# EAGLE design cosv-carrier-teensy40 (EAGLE 7.6.0)
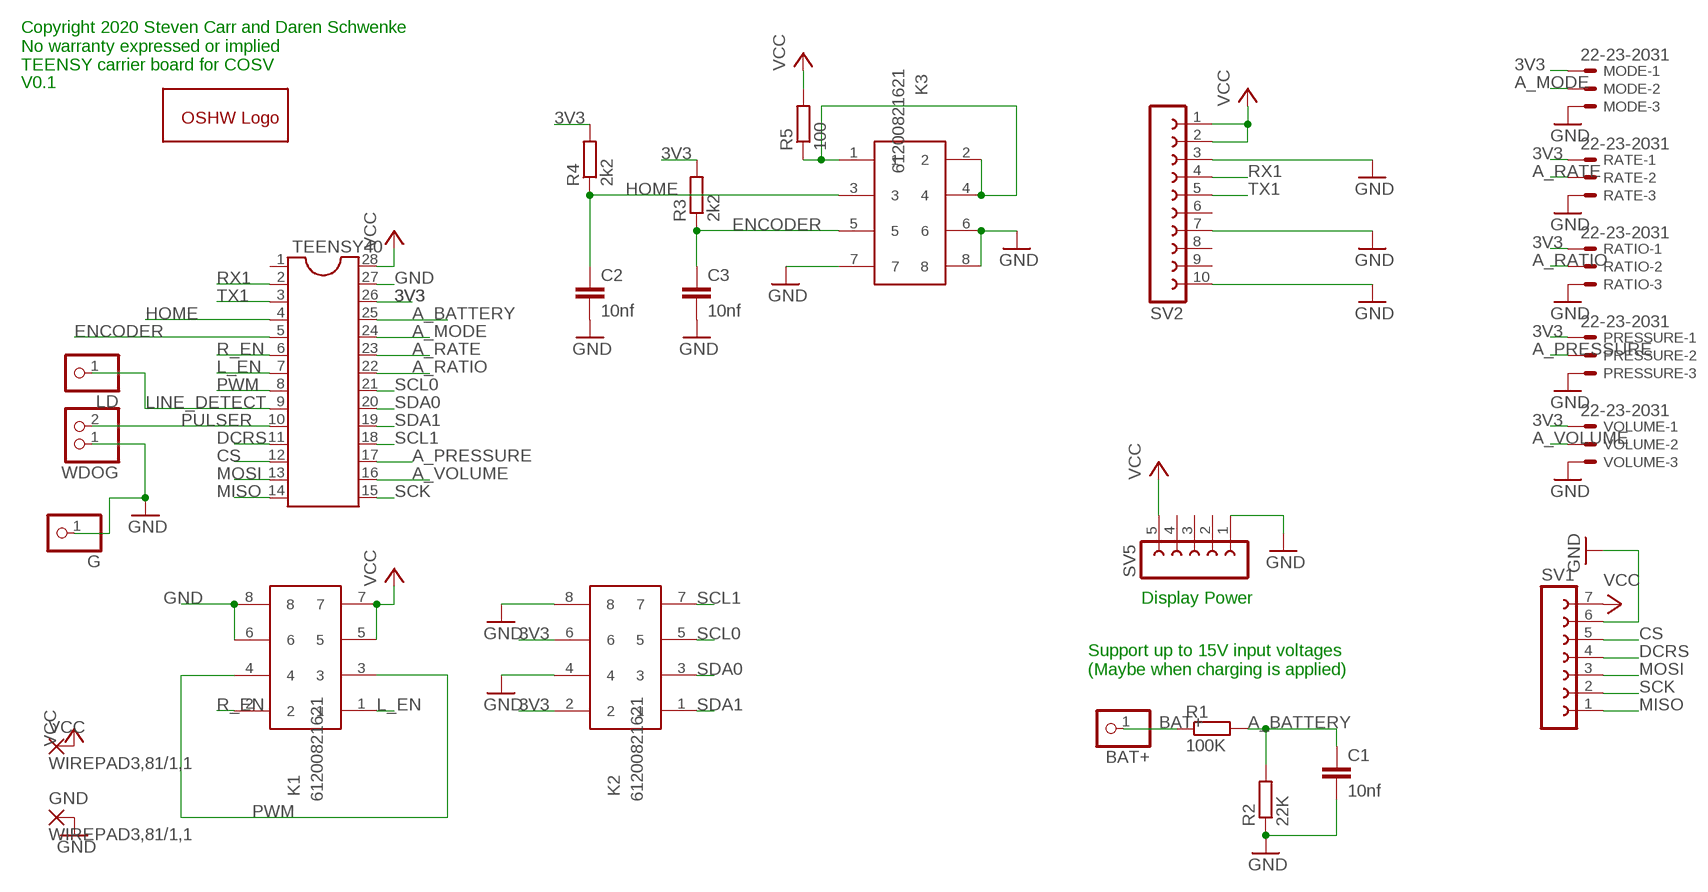
[diagram p0: schematic, sheet 1]

## Parts
BAT+  PINHD-1X01_2.54-S  [1X01-S]
C1  10nf  C-EUC1206  [C1206]
C2  10nf  C-EUC1206  [C1206]
C3  10nf  C-EUC1206  [C1206]
G  PINHD-1X01_2.54-S  [1X01-S]
GND  WIREPAD3,81/1,1  [3,81/1,1]
GOLD_ORB_SM1  OSHWLOGOLOGO8MM  [OSHW_8MM]
K1  61200821621  [61200821621]
K2  61200821621  [61200821621]
K3  61200821621  [61200821621]
LD  PINHD-1X01_2.54-S  [1X01-S]
MODE  22-23-2031  [22-23-2031]
PRESSURE  22-23-2031  [22-23-2031]
R1  100K  R-EU_R1206  [R1206]
R2  22K  R-EU_R1206  [R1206]
R3  2k2  R-EU_R1206  [R1206]
R4  2k2  R-EU_R1206  [R1206]
R5  100  R-EU_R1206  [R1206]
RATE  22-23-2031  [22-23-2031]
RATIO  22-23-2031  [22-23-2031]
SV1  FE07-1  [FE07]
SV2  FE10-1  [FE10]
SV5  FE05W  [FE05W]
TEENSY40  DIL28  [DIL28-6]
VCC  WIREPAD3,81/1,1  [3,81/1,1]
VOLUME  22-23-2031  [22-23-2031]
WDOG  PINHD-1X2  [1X02]

## Nets
3V3 [power]: K2.2 K2.6 MODE.1 PRESSURE.1 R3.2 R4.2 RATE.1 RATIO.1 TEENSY40.26 VOLUME.1
A_BATTERY: C1.1 R1.2 R2.2 TEENSY40.25
A_MODE: MODE.2 TEENSY40.24
A_PRESSURE: PRESSURE.2 TEENSY40.17
A_RATE: RATE.2 TEENSY40.23
A_RATIO: RATIO.2 TEENSY40.22
A_VOLUME: TEENSY40.16 VOLUME.2
BAT+: BAT+.1 R1.1
CS: SV1.5 TEENSY40.12
DCRS: SV1.4 TEENSY40.11
ENCODER: C3.1 K3.5 R3.1 TEENSY40.5
GND [ground]: C1.2 C2.2 C3.2 G.1 GND.1(P) K1.6 K1.8 K2.4 K2.8 K3.6 K3.7 K3.8 MODE.3 PRESSURE.3 R2.1 RATE.3 RATIO.3 SV1.6 SV2.3 SV2.7 SV2.10 SV5.1 TEENSY40.27 VOLUME.3 WDOG.1
HOME: C2.1 K3.3 R4.1 TEENSY40.4
L_EN: K1.1 TEENSY40.7
LINE_DETECT: LD.1 TEENSY40.9
MISO: SV1.1 TEENSY40.14
MOSI: SV1.3 TEENSY40.13
N$1: K3.1 K3.2 K3.4 R5.1
PULSER: TEENSY40.10 WDOG.2
PWM: K1.3 K1.4 TEENSY40.8
R_EN: K1.2 TEENSY40.6
RX1: SV2.4 TEENSY40.2
SCK: SV1.2 TEENSY40.15
SCL0: K2.5 TEENSY40.21
SCL1: K2.7 TEENSY40.18
SDA0: K2.3 TEENSY40.20
SDA1: K2.1 TEENSY40.19
TX1: SV2.5 TEENSY40.3
VCC [power]: K1.5 K1.7 R5.2 SV1.7 SV2.1 SV2.2 SV5.5 TEENSY40.28 VCC.1(P)
Unconnected: SV2.6 SV2.8 SV2.9 SV5.2 SV5.3 SV5.4 TEENSY40.1

## Notes on the sheet
- Copyright 2020 Steven Carr and Daren Schwenke
  No warranty expressed or implied
  TEENSY carrier board for COSV
- V0.1
- Display Power
- Support up to 15V input voltages
  (Maybe when charging is applied)

## Library data of the parts
BAT+ G LD = pinhead-2:PINHD-1X01: PIN HEADER
C1-C3 = rcl:C-EU: CAPACITOR, European symbol
GND VCC = wirepad:WIREPAD: Wire PAD connect wire on PCB
GOLD_ORB_SM1 = oshw:OSHWLOGO: The OSHW logo for PCB layout
K1-K3 = Wuerth_Elektronik_eiCan_05_Box_Header_IDC_Connectors_1_2:61200821621: WR-BHD 2.54mm Male Box Header, 8 Pins
MODE PRESSURE RATE RATIO VOLUME = con-molex:22-23-2031: .100" (2.54mm) Center Header - 3 Pin; MF: MOLEX; MPN: 22-23-2031; OC_FARNELL: 1462950; OC_NEWARK: 30C0862
R1-R5 = resistor:R-EU_: RESISTOR, European symbol
SV1 = con-lsta:FE07-1: FEMALE HEADER; OC_FARNELL: unknown; OC_NEWARK: unknown
SV2 = con-lsta:FE10-1: FEMALE HEADER; OC_FARNELL: unknown; OC_NEWARK: unknown
SV5 = con-lsta:FE05W: FEMALE HEADER; OC_FARNELL: unknown; OC_NEWARK: unknown
TEENSY40 = ic-package:DIL28: Dual In Line
WDOG = pinhead:PINHD-1X2: PIN HEADER

## Net classes
0 default: width 0.254 mm
1 ground: width 0.508 mm
2 power: width 0.508 mm

## Board
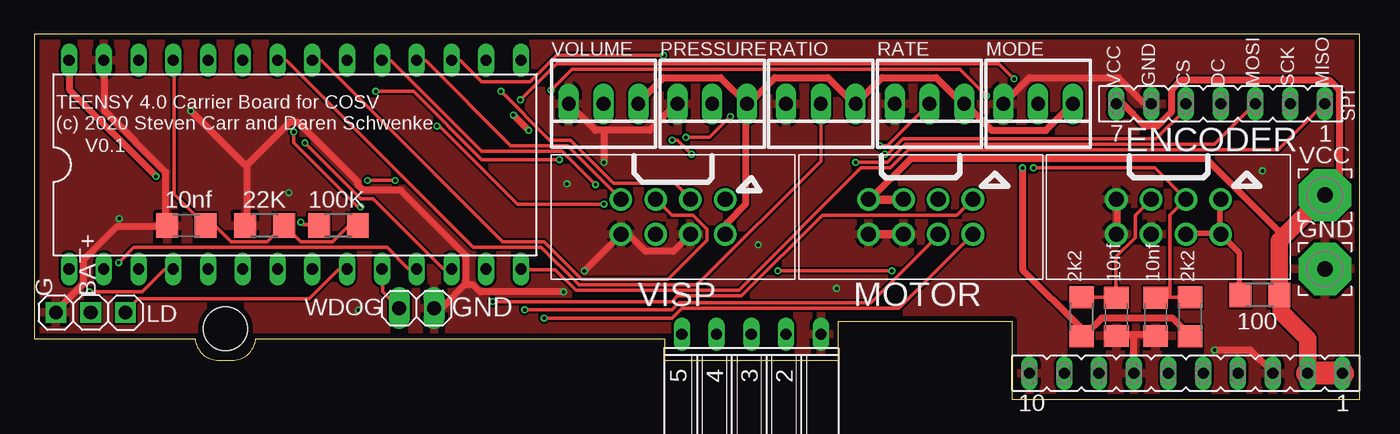
[diagram p1: board, top side]
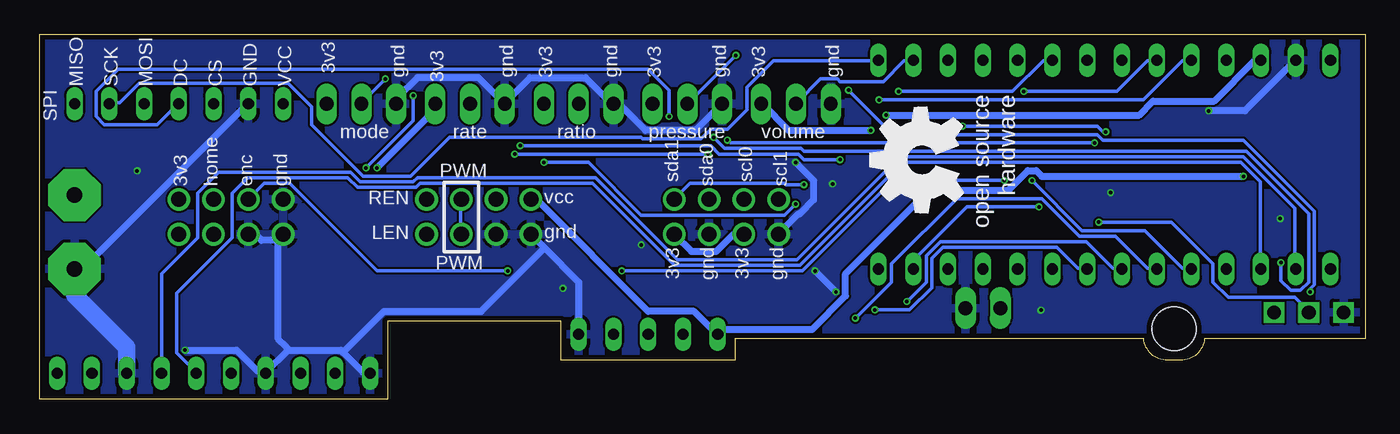
[diagram p2: board, bottom side, seen from below]

Size 96.84 x 26.67 mm. Coordinates in mm from the lower left corner, seen from the top.
Outline: 0,4.44 11.75,4.44 arc90 13.65,2.86 14.29,2.86 arc90 16.19,4.44 46.04,4.44 46.04,2.86 58.74,2.86 58.74,5.72 71.44,5.72 71.44,0 96.84,0 96.84,26.66 7,26.66 6.98,26.67 0,26.67 0,4.44
Copper layers (1*16): Top 0.035559375mm / dielectric 1.6mm / Bottom 0.035559375mm
Design rules "oshpark-2layer *": minimum track width 6mil, minimum drill 10mil, track to track 6mil, track to pad 6mil, pad to pad 6mil, via to via 6mil, smd to smd 6mil, copper to edge 15mil, drill to drill 6mil, minimum pad ring 5mil, minimum via ring 5mil, stop-mask expansion 2.5mil, vias tented up to drill 13mil, thermal gap 10mil
Holes 3.2 mm at 13.97,5.16

### Footprints (pad centres in the part's own frame; a part is rotated, then mirrored left to right if it is on the bottom)
1X01-S = drill 1.016 square: 1 0,0
C1206 = smd 1.6 x 1.8: 1 -1.4,0; 2 1.4,0
3,81/1,1 = drill 1.118 pad 3.81 octagon: 1 0,0
61200821621 = drill 1.1: 1 -2.54,-1.27; 2 -2.54,1.27; 3 0,-1.27; 4 0,1.27; 5 2.54,-1.27; 6 2.54,1.27; 7 5.08,-1.27; 8 5.08,1.27
22-23-2031 = drill 1 long: 1 -2.54,0; 2 0,0; 3 2.54,0
R1206 = smd 1.6 x 1.803: 1 -1.422,0; 2 1.422,0
FE07 = drill 0.813 long: 1 -7.62,0; 2 -5.08,0; 3 -2.54,0; 4 0,0; 5 2.54,0; 6 5.08,0; 7 7.62,0
FE10 = drill 0.813 long: 1 -11.43,0; 2 -8.89,0; 3 -6.35,0; 4 -3.81,0; 5 -1.27,0; 6 1.27,0; 7 3.81,0; 8 6.35,0; 9 8.89,0; 10 11.43,0
FE05W = drill 0.813 long: 1 -5.08,0; 2 -2.54,0; 3 0,0; 4 2.54,0; 5 5.08,0
DIL28-6 = drill 0.813 long: 1 -16.51,-7.62; 2 -13.97,-7.62; 3 -11.43,-7.62; 4 -8.89,-7.62; 5 -6.35,-7.62; 6 -3.81,-7.62; 7 -1.27,-7.62; 8 1.27,-7.62; 9 3.81,-7.62; 10 6.35,-7.62; 11 8.89,-7.62; 12 11.43,-7.62; 13 13.97,-7.62; 14 16.51,-7.62; 15 16.51,7.62; 16 13.97,7.62; 17 11.43,7.62; 18 8.89,7.62; 19 6.35,7.62; 20 3.81,7.62; 21 1.27,7.62; 22 -1.27,7.62; 23 -3.81,7.62; 24 -6.35,7.62; 25 -8.89,7.62; 26 -11.43,7.62; 27 -13.97,7.62; 28 -16.51,7.62
1X02 = drill 1.016 long: 1 -1.27,0; 2 1.27,0

### Placement (x,y rotation side)
BAT+  4.13,6.35 270 top
C1  11.11,12.7 180 top
C2  81.91,6.03 270 top
C3  79.06,6.03 270 top
G  1.59,6.35 0 top
GND  94.3,9.53 0 top
GOLD_ORB_SM1  32.38,17.46 90 bottom
K1  66.04,13.33 180 top
K2  47.94,13.33 180 top
K3  84.14,13.33 180 top
LD  6.67,6.35 90 top
MODE  73.34,21.59 180 top
PRESSURE  49.53,21.59 180 top
R1  22.23,12.7 0 top
R2  16.83,12.7 0 top
R3  76.52,6.03 270 top
R4  84.45,6.03 270 top
R5  89.53,7.62 0 top
RATE  65.4,21.59 180 top
RATIO  57.47,21.59 180 top
SV1  86.68,21.59 180 top
SV2  84.14,1.91 180 top
SV5  52.39,4.76 180 top
TEENSY40  19.05,17.15 0 top
VCC  94.3,14.92 0 top
VOLUME  41.59,21.59 180 top
WDOG  27.94,6.67 180 top

### Tracks (layer width: path | path; a pad name or v marks a point on that pad's centre or on a via)
3V3  (via drill 0.25)
  Top 0.508: R4.2 84.39,4.71 83.17,5.93 77.99,5.93 76.77,4.71 76.57,4.71 R3.2 76.47,4.91 76.47,5.22 72.2,9.49 v72.2,16.9 | v36.13,19.65 v35.01,20.76 | PRESSURE.1 50.15,23.51 45.99,23.51 44.16,21.68 VOLUME.1 | PRESSURE.1 52.29,21.68 54.11,23.51 57.98,23.51 59.8,21.68 60.01,21.68 RATIO.1 60.21,21.78 61.94,23.51 65.9,23.51 67.73,21.68 67.93,21.68 RATE.1 68.14,21.48 69.96,19.65 73.93,19.65 75.86,21.58 MODE.1 | K2.2 50.56,12.13 50.56,12.84 51.98,14.26 51.98,21.37 PRESSURE.1
  Bottom 0.508: K2.6 45.48,12.03 46.19,12.03 47.41,10.81 49.24,10.81 50.46,12.03 K2.2 | v35.01,20.76 16.52,20.76 15.51,21.78 11.04,21.78 8.09,24.73 7.68,24.73 TEENSY40.26 | v36.13,19.65 42.13,19.65 44.06,21.58 VOLUME.1 | v72.2,16.9 68.03,21.07 68.03,21.58 RATE.1
A_BATTERY
  Top 0.254: R1.2 23.63,12.64 22.92,12.64 21.81,11.52 19.47,11.52 18.35,12.64 R2.2 18.15,12.64 17.03,11.52 14.39,11.52 13.27,12.64 12.56,12.64 C1.1 12.46,12.74 10.22,14.97 10.22,24.73 TEENSY40.25
A_MODE  (via drill 0.25)
  Top 0.254: v35.52,21.88 38.16,24.52 70.47,24.52 v71.59,23.41
  Bottom 0.254: v35.52,21.88 16.22,21.88 13.37,24.73 12.76,24.73 TEENSY40.24 | v71.59,23.41 73.32,21.68 MODE.2
A_PRESSURE  (via drill 0.25)
  Top 0.254: v45.99,25.13 38.16,25.13 36.23,23.2 32.68,23.2 31.15,24.73 30.54,24.73 TEENSY40.17
  Bottom 0.254: PRESSURE.2 v45.99,25.13
A_RATE  (via drill 0.25)
  Top 0.254: v24.96,22.49 27.7,22.49 32.68,17.51 v38.37,17.51 | v61.73,18.53 62.34,18.53 RATE.2
  Bottom 0.254: v24.96,22.49 18.15,22.49 15.91,24.73 15.3,24.73 TEENSY40.23 | v38.37,17.51 41.01,17.51 41.41,17.92 47.21,17.92 47.82,18.53 v61.73,18.53
A_RATIO
  Top 0.254: RATIO.2 57.47,17.41 48.43,8.37 39.79,8.37 37.05,11.11 32.07,11.11 18.45,24.73 17.84,24.73 TEENSY40.22
A_VOLUME
  Bottom 0.254: TEENSY40.16 33.08,24.73 33.69,24.73 35.22,23.2 38.37,23.2 38.57,23.41 39.79,23.41 41.52,21.68 VOLUME.2
BAT+  (via drill 0.25)
  Top 0.254: v19.47,12.94 19.67,12.74 20.79,12.74 R1.1
  Bottom 0.254: v19.47,12.94 14.19,12.94 11.14,9.89 11.14,8.57 10.02,7.45 5.14,7.45 4.13,6.44 BAT+.1
CS  (via drill 0.25)
  Top 0.254: v19.77,18.73 23.84,14.67 24.75,14.67 29.83,9.59 30.44,9.59 TEENSY40.12 | v46.6,18.94 47,18.94 v48.02,17.92 | v62.14,17.92 62.34,17.92 63.46,19.04 81.95,19.04 84.09,21.17 84.09,21.58 SV1.5
  Bottom 0.254: v19.77,18.73 46.39,18.73 v46.6,18.94 | v62.14,17.92 v48.02,17.92
DCRS  (via drill 0.25)
  Top 0.254: v6.16,9.99 7.28,11.11 25.77,11.11 27.29,9.59 27.9,9.59 TEENSY40.11 | v47.61,19.14 49.34,19.14 v50.86,20.66
  Bottom 0.254: v6.16,9.99 6.16,8.67 5.45,7.96 4.74,7.96 4.13,8.57 4.13,13.55 8.7,18.12 41.01,18.12 41.21,18.33 46.8,18.33 v47.61,19.14 | v50.86,20.66 50.86,22.59 52.39,24.12 91.1,24.12 92.72,22.49 92.72,20.66 92.11,20.05 88.25,20.05 86.73,21.58 SV1.4
ENCODER  (via drill 0.25)
  Top 0.254: R3.1 76.57,7.45 79.01,7.45 C3.1 79.01,7.56 79.01,10.4 80.43,11.82 80.43,13.45 81.55,14.57 K3.5 | v26.38,15.99 v24.35,15.99 | v62.65,9.39 v54.32,9.39
  Bottom 0.254: v24.35,15.99 20.69,12.33 16.12,12.33 13.37,9.59 12.76,9.59 TEENSY40.5 | v26.38,15.99 34.51,15.99 41.11,9.39 v54.32,9.39 | v62.65,9.39 72.2,9.39 78.6,15.79 80.43,15.79 81.55,14.67 K3.5
GND  (via drill 0.25)
  Top 0.508: 15.51,17.11 15.51,12.74 R2.1 | 15.51,17.11 18.66,20.26 19.27,20.26 23.63,15.89 23.63,15.68 24.04,15.28 26.78,15.28 31.56,10.5 31.56,8.47 | 31.56,8.47 29.83,6.74 29.22,6.74 WDOG.1 | G.1 1.59,6.44 3.62,8.47 3.62,10.2 6.06,12.64 9.61,12.64 C1.2 9.61,12.84 9.61,16.6 5.14,21.07 5.14,24.73 TEENSY40.27 | v11.44,21.07 15.3,17.21 15.51,17.11 | K3.8 79.11,12.13 79.11,14.57 K3.7 | 80.33,4.71 81.85,4.71 C2.2 | 80.33,4.71 79.11,4.71 C3.2 | SV2.7 80.33,4.71 | SV1.6 81.55,21.68 81.04,21.68 79.21,23.51 72.71,23.51 70.88,21.68 MODE.3 | K2.4 47.92,12.03 46.7,10.81 44.67,10.81 43.45,12.03 42.94,12.03 K2.8 42.74,11.93 v40.2,9.39 | 41.62,19.65 44.97,19.65 46.9,21.58 PRESSURE.3 | 41.62,19.65 41.01,19.65 39.08,21.58 VOLUME.3 | 41.62,19.65 v41.62,17.31 | v86.22,3.59 88.86,3.59 90.49,1.97 SV2.3 | v38.67,7.86 32.58,7.86 32.07,8.37 31.76,8.37 31.56,8.47
  Top 0.61: K1.8 K1.6
  Bottom 0.508: v11.44,21.07 8.8,21.07 5.14,24.73 TEENSY40.27 | SV5.1 57.47,8.57 59.96,11.06 | K1.8 59.96,11.06 | K3.6 81.55,12.03 81.04,12.03 80.63,11.62 79.51,11.62 79.11,12.03 K3.8 79.41,11.42 79.41,4.41 78.8,3.8 78.7,3.59 | 74.69,3.44 74.84,3.59 78.7,3.59 | 74.69,3.44 73.22,1.97 72.71,1.97 SV2.10 | 78.7,3.59 80.33,1.97 SV2.7 80.53,2.07 80.94,2.07 82.46,3.59 v86.22,3.59 | 59.96,11.06 64.58,6.44 71.69,6.44 74.69,3.44 | v41.62,17.31 40.3,15.99 40.3,14.57 41.31,13.55 41.41,13.55 42.84,12.13 K2.8 | PRESSURE.3 48.93,19.65 52.59,19.65 54.42,21.48 54.72,21.48 RATIO.3 54.93,21.68 55.13,21.68 56.96,23.51 61.02,23.51 62.85,21.68 RATE.3 64.78,23.51 69.25,23.51 70.78,21.98 70.78,21.68 MODE.3 | GND.1 93.74,9.79 93.43,9.79 81.65,21.58 SV1.6 | v40.2,9.39 v38.67,7.86
  Bottom 1.27: GND.1 94.3,7.62 90.49,3.81 SV2.3
  other vias: 52.9,11.29 38.93,15.74 18.61,15.1 23.69,6.53 58.61,8.12 6.22,13.2 89.73,16.69
  pour Bottom: 0,26.67 96.84,26.67 96.84,0 71.44,0 71.44,5.71 58.74,5.71 58.74,2.86 46.04,2.86 46.04,4.45 16.19,4.45 16.19,2.86 11.75,2.86 11.75,4.45 0,4.45
  pour Top: 0,26.67 96.84,26.67 96.84,-0.32 71.44,-0.32 71.44,5.71 58.74,5.71 58.74,2.86 46.04,2.86 46.04,4.45 16.19,4.45 16.19,2.86 11.75,2.86 11.75,4.45 0,4.45
HOME  (via drill 0.25)
  Top 0.254: 82.97,7.45 84.39,7.45 R4.1 | 82.97,7.45 81.95,7.45 C2.1 | v4.03,7.86 7.89,7.86 9.51,9.49 10.12,9.49 TEENSY40.4 | v37.76,22.59 39.28,24.12 67.63,24.12 v69.56,22.19 | v73.01,16.9 81.85,16.9 84.09,14.67 K3.3 84.09,14.57 82.97,13.45 82.97,7.45
  Bottom 0.254: v4.03,7.86 4.03,8.06 3.72,8.37 3.72,13.75 8.9,18.94 19.16,18.94 19.57,19.34 34.51,19.34 v37.76,22.59 | v69.56,22.19 69.56,20.36 v73.01,16.9
L_EN  (via drill 0.25)
  Top 0.254: v33.49,7.15 46.6,7.15 47,7.56 51.68,7.56 57.57,13.45 67.42,13.45 K1.1
  Bottom 0.254: v33.49,7.15 32.07,8.57 32.07,10.5 31.05,11.52 20.38,11.52 18.45,9.59 17.84,9.59 TEENSY40.7
LINE_DETECT
  Top 0.254: TEENSY40.9 22.82,9.49 22.21,9.49 20.08,7.35 7.58,7.35 6.67,6.44 LD.1
MISO
  Top 0.254: TEENSY40.14 35.62,9.49 38.06,9.49 39.59,7.96 51.47,7.96 60.41,16.9 62.55,16.9 63.87,18.22 90.89,18.22 94.25,21.58 SV1.1
MOSI  (via drill 0.25)
  Top 0.254: v23.84,14.06 23.63,14.06 18.96,18.73 v18.96,19.55 | v29.43,19.95 29.63,19.95 35.32,14.26 v41.62,14.26 | v60.01,17.31 62.34,17.31 63.67,18.63 86.22,18.63 89.17,21.58 SV1.3
  Bottom 0.254: v23.84,14.06 29.12,14.06 32.98,10.2 32.98,9.59 TEENSY40.13 | v18.96,19.55 19.16,19.55 19.57,19.95 v29.43,19.95 | v41.62,14.26 42.43,13.45 52.9,13.45 56.76,17.31 v60.01,17.31
N$1
  Top 0.254: 88.05,7.66 R5.1 | 86.73,12.03 K3.2 | 86.63,12.13 K3.2 | 86.63,12.23 K3.2
  Top 0.406: 88.05,7.66 88.05,10.71 86.73,12.03 | 86.63,12.13 84.19,12.13 K3.4 | 86.63,12.23 86.63,14.57 K3.1
PULSER
  Top 0.254: TEENSY40.10 25.46,9.49 25.46,7.86 26.58,6.74 WDOG.2
PWM  (via drill 0.25)
  Top 0.254: v35.83,6.54 46.6,6.54 47.1,7.05 61.13,7.05 66.1,12.03 K1.4
  Bottom 0.254: v35.83,6.54 33.29,6.54 31.66,8.17 31.66,10.3 30.85,11.11 22.52,11.11 20.99,9.59 20.38,9.59 TEENSY40.8 | K1.3 66.1,14.57 66.1,12.13 K1.4
R_EN  (via drill 0.25)
  Top 0.254: v37.25,5.93 46.6,5.93 47.31,6.64 63.16,6.64 K1.2
  Bottom 0.254: v37.25,5.93 34.61,8.57 34.61,9.89 29.83,14.67 23.63,14.67 20.89,11.93 18.25,11.93 15.91,9.59 15.3,9.59 TEENSY40.6
RX1
  Bottom 0.254: SV2.4 87.95,9.18 85.31,11.82 85.31,15.07 83.78,16.6 74.13,16.6 73.42,15.89 69.56,15.89 69.25,16.19 56.25,16.19 50.25,10.2 41.52,10.2 34,17.72 8.9,17.72 5.14,13.96 5.14,9.59 TEENSY40.2
SCK
  Bottom 0.254: SV1.2 91.71,21.68 91,21.68 89.57,23.1 78.7,23.1 76.97,21.37 76.97,20.05 73.22,16.29 69.76,16.29 66.92,19.14 52.9,19.14 52.79,19.04 48.53,19.04 47.82,19.75 46.6,19.75 45.17,21.17 45.17,22.8 43.24,24.73 35.62,24.73 TEENSY40.15
SCL0
  Top 0.254: TEENSY40.21 20.38,24.73 20.99,24.73 34.2,11.52 37.25,11.52 39.99,8.78 46.29,8.78 49.14,11.62 49.14,12.43 48.12,13.45 46.6,13.45 45.48,14.57 K2.5
SCL1
  Top 0.254: TEENSY40.18 28,24.73 28.61,24.73 34.81,18.53 38.98,18.53 42.84,14.67 K2.7
SDA0  (via drill 0.25)
  Top 0.254: v34.1,22.49 37.66,18.94 39.18,18.94 42.33,15.79 46.8,15.79 47.92,14.67 K2.3
  Bottom 0.254: v34.1,22.49 25.77,22.49 23.53,24.73 22.92,24.73 TEENSY40.20
SDA1  (via drill 0.25)
  Top 0.254: v41.01,15.68 38.57,18.12 32.68,18.12 26.07,24.73 25.46,24.73 TEENSY40.19
  Bottom 0.254: v41.01,15.68 42.33,15.68 42.43,15.79 49.34,15.79 50.46,14.67 K2.1
TX1
  Bottom 0.254: SV2.5 85.41,1.97 86.83,3.39 86.83,7.76 82.77,11.82 82.77,15.07 81.65,16.19 74.33,16.19 73.62,15.48 69.35,15.48 69.05,15.79 56.45,15.79 50.46,9.79 41.31,9.79 33.79,17.31 9.11,17.31 7.68,15.89 7.68,9.59 TEENSY40.3
VCC  (via drill 0.25)
  Top 0.508: SV1.7 79.11,21.58 79.51,21.58 81.14,19.95 82.05,19.95 83.07,20.97 83.07,22.59 83.78,23.3 94.65,23.3 95.36,22.59 95.36,16.29 94.55,15.48 VCC.1 | v8.9,16.29 2.6,22.59 2.6,24.73 TEENSY40.28 | 91.3,11.93 85.61,17.61 64.07,17.61 61.02,14.57 K1.7
  Top 0.61: 61.02,14.57 63.46,14.57 K1.5
  Top 1.27: SV2.2 93.03,4.44 91.12,6.35 91.12,7.45 R5.2 90.96,11.58 91.3,11.93 VCC.1
  Top 1.676: SV2.1 SV2.2
  Bottom 0.508: v8.9,16.29 23.63,16.29 24.04,16.7 24.65,16.7 26.07,15.28 31.86,15.28 37.96,9.18 37.96,7.56 40.4,5.12 47,5.12 47.31,4.81 SV5.5 47.51,4.91 49.03,6.44 52.39,6.44 60.52,14.57 60.92,14.57 K1.7

### Text on the board
tNames: VCC | GND | CS | DC | MOSI | SCK | MISO | SPI | TEENSY 4.0 Carrier Board for COSV / (c) 2020 Steven Carr and Daren Schwenke | V0.1 | ENCODER | VISP | MOTOR | GND
bNames: gnd | 3v3 | gnd | 3v3 | gnd | 3v3 | gnd | 3v3 | gnd | 3v3 | VCC | GND | CS | DC | MOSI | SCK | MISO | SPI | volume | pressure | ratio | rate | mode | PWM | scl1 | scl0 | sda0 | sda1 | REN | gnd | enc | home | 3v3 | vcc | LEN | gnd | 3v3 | gnd | 3v3 | gnd | PWM